# Altium schematic sheet STM32-ROMI_Rev_A_4_3V_5V.SchDoc: Power
size A; DocumentNumber: 7122020; Revision: A; SheetNumber: 4; SheetTotal: 7
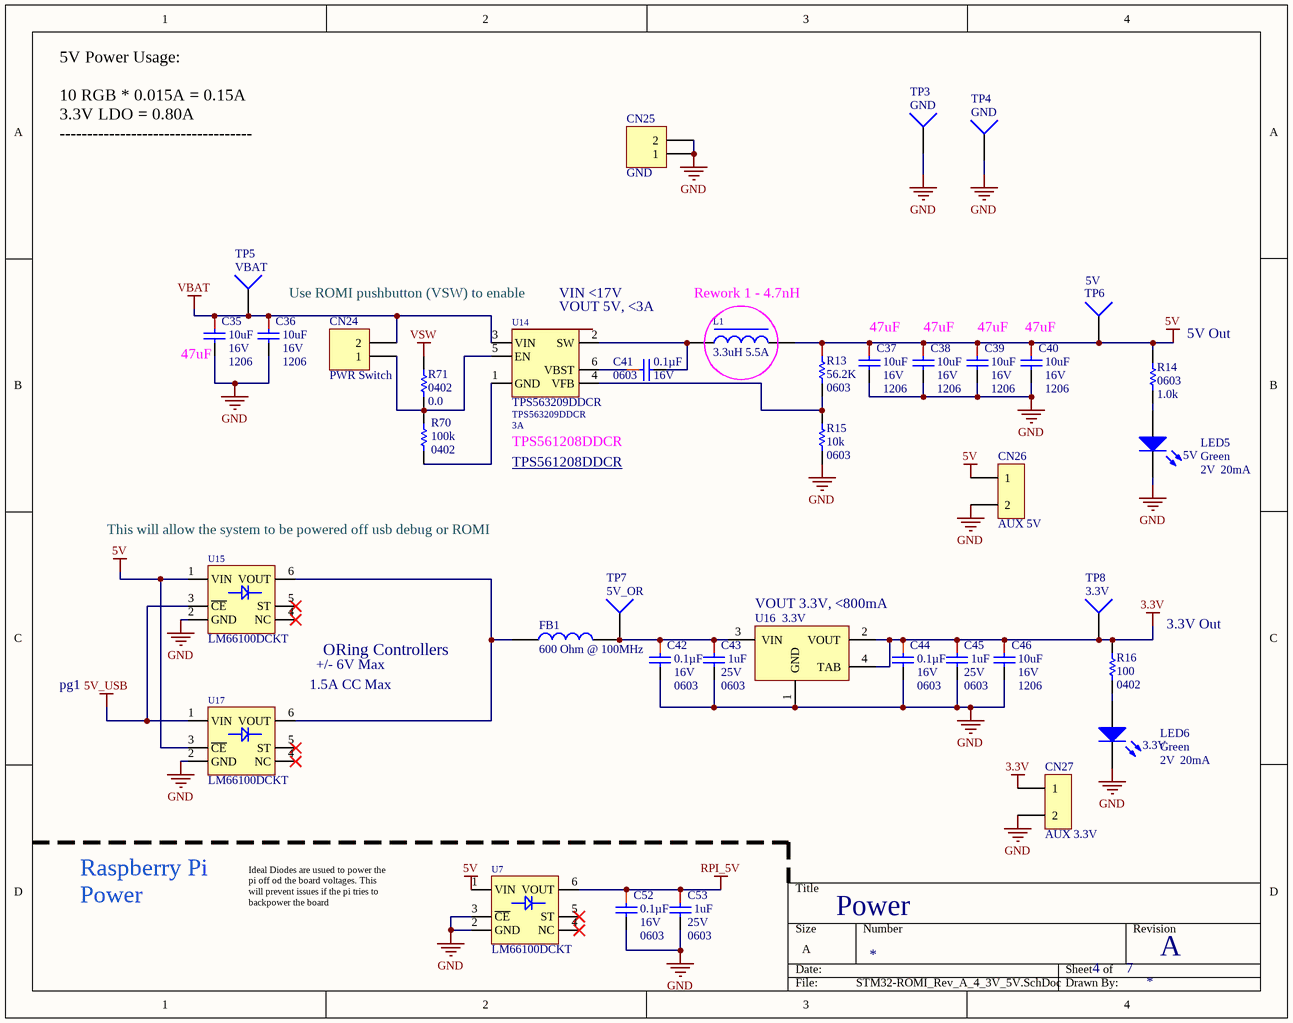
[diagram p0: STM32-ROMI_Rev_A_4_3V_5V.SchDoc]

## Parts
C35  10uF  Voltage - Rated: 16V  Package: 1206  [CAPC1206(3216)_M]
C36  10uF  Voltage - Rated: 16V  Package: 1206  [CAPC1206(3216)_M]
C37  10uF  Voltage - Rated: 16V  Package: 1206  [CAPC1206(3216)_M]
C38  10uF  Voltage - Rated: 16V  Package: 1206  [CAPC1206(3216)_M]
C39  10uF  Voltage - Rated: 16V  Package: 1206  [CAPC1206(3216)_M]
C40  10uF  Voltage - Rated: 16V  Package: 1206  [CAPC1206(3216)_M]
C41  Capacitance: 0.1µF  Package / Case: 0603  Voltage - Rated: 16V  [CAPC0603(1608)_L]  (hidden comment: 0.1uF)
C42  Capacitance: 0.1µF  Package / Case: 0603  Voltage - Rated: 16V  [CAPC0603(1608)_L]  (hidden comment: 0.1uF)
C43  1uF  Voltage - Rated: 25V  Package / Case: 0603  [CAPC0603(1608)_N]
C44  Capacitance: 0.1µF  Package / Case: 0603  Voltage - Rated: 16V  [CAPC0603(1608)_L]  (hidden comment: 0.1uF)
C45  1uF  Voltage - Rated: 25V  Package / Case: 0603  [CAPC0603(1608)_N]
C46  10uF  Voltage - Rated: 16V  Package: 1206  [CAPC1206(3216)_M]
C52  Capacitance: 0.1µF  Package / Case: 0603  Voltage - Rated: 16V  [CAPC0603(1608)_L]  (hidden comment: 0.1uF)
C53  1uF  Voltage - Rated: 25V  Package / Case: 0603  [CAPC0603(1608)_N]
CN24  PWR Switch  [HDR1X2]
CN25  GND  [HDR1X2]
CN26  AUX 5V  [Molex 1x2 Microfit 3.0]
CN27  AUX 3.3V  [Molex 1x2 Microfit 3.0]
FB1  600 Ohm @ 100MHz  [RESC0805(2012)_N]
L1  3.3uH 5.5A  [YSPI0530-3R3M]
LED5  5V  Color: Green  Voltage - Forward (Vf) (Typ): 2V  Current - Test: 20mA  [SM-LED-0603]
LED6  3.3V  Color: Green  Voltage - Forward (Vf) (Typ): 2V  Current - Test: 20mA  [SM-LED-0603]
R13  56.2K  Package / Case: 0603  [RESC0603(1608)_L]
R14  Package / Case: 0603  [RESC0603(1608)_N]  (hidden comment: 1.0K)
R15  Resistance (Ohms): 10k  Package / Case: 0603  [RESC0603(1608)_L]  (hidden comment: 10K 1%)
R16  100  Supplier Device Package: 0402  [RESC0402(1005)_N]
R70  Supplier Device Package: 0402  Resistance (Ohms): 100k  [RESC0402(1005)_L]  (hidden comment: 100K 0402)
R71  Supplier Device Package: 0402  Resistance (Ohms): 0.0  [RESC0402(1005)_L]  (hidden comment: 0)
TP3  GND  [TestPoint-SM]  (no BOM)
TP4  GND  [TestPoint-SM]  (no BOM)
TP5  VBAT  [TestPoint-SM]  (no BOM)
TP6  5V  [TestPoint-SM]  (no BOM)
TP7  5V_OR  [TestPoint-SM]  (no BOM)
TP8  3.3V  [TestPoint-SM]  (no BOM)
U7  LM66100DCKT  [SC-70-6]
U14  TPS563209DDCR  Current - Output: 3A  [SOT23-6]
U15  LM66100DCKT  [SC-70-6]
U16  3.3V  [DSO-G3]
U17  LM66100DCKT  [SC-70-6]

## Nets
3.3V: C44.1 C45.1 C46.1 CN27.1 R16.2 TP8.1 U16.2(VOUT) U16.4(TAB)
5V: C37.1 C38.1 C39.1 C40.1 CN26.1 L1.2 R13.1 R14.2 TP6.1 U7.1(VIN) U15.1(VIN) U17.3(~{CE})
5V_USB: U15.3(~{CE}) U17.1(VIN)
GND: C35.2 C36.2 C37.2 C38.2 C39.2 C40.2 C42.2 C43.2 C44.2 C45.2 C46.2 C52.2 C53.2 CN25.1 CN25.2 CN26.2 CN27.2 LED5.2 LED6.2 R15.1 TP3.1 TP4.1 U7.2(GND) U7.3(~{CE}) U15.2(GND) U16.1(GND) U17.2(GND)
RPI_5V: C52.1 C53.1 U7.6(VOUT)
VBAT: C35.1 C36.1 CN24.2 TP5.1 U14.3(VIN)
VSW: R71.1
NetC41_1: C41.1 U14.6(VBST)
NetC41_2: C41.2 L1.1 U14.2(SW)
NetC42_1: C42.1 C43.1 FB1.2 TP7.1 U16.3(VIN)
NetCN24_1: CN24.1 R70.2 R71.2 U14.5(EN)
NetFB1_1: FB1.1 U15.6(VOUT) U17.6(VOUT)
NetLED5_1: LED5.1 R14.1
NetLED6_1: LED6.1 R16.1
NetR13_2: R13.2 R15.2 U14.4(VFB)
NetR70_1: R70.1 U14.1(GND)

Not connected (* = marked no-connect by the designer): U7 4(NC)* 5(ST)*; U15 4(NC)* 5(ST)*; U17 4(NC)* 5(ST)*

## Notes on the sheet
- 5V Power Usage:
  10 RGB * 0.015A = 0.15A
  3.3V LDO = 0.80A
  -----------------------------------
  = 0.95A
- Use ROMI pushbutton (VSW) to enable
- (near U14) VIN <17V
- Rework 1 - 4.7nH
- (near C35) 47uF
- (near U14) VOUT 5V, <3A
- 47uF
- (near C40) 47uF
- (near R14) 5V Out
- TPS561208DDCR
- TPS561208DDCR <https://webench.ti.com/appinfo/webench/scripts/SDP.cgi?ID=1CC5C5774496E8D5>
- (near U15) This will allow the system to be powered off usb debug or ROMI
- (near U16) VOUT 3.3V, <800mA
- 3.3V Out
- pg1
- 1.5A CC Max
- +/- 6V Max
- ORing Controllers
- Raspberry Pi
- Power
- Ideal Diodes are usued to power the pi off od the board voltages. This will prevent issues if the pi tries to backpower the board

## Library data of the parts
C35-C40 C46 = CAP CER 10UF 16V 1206: Temperature Coefficient: X7R; LCSC: C126600; Capacitance: 10uF; Supplier 1: Digi-Key; Supplier Part Number 1: 490-4793-1-ND
C41 C42 C44 C52 = CAP CER 0.1UF 16V 10% X7R 0603: 0.1uF 0603 16V; Manufacturer: Kemet; Manufacturer Part Number: C0603C104K4RACTU; Tolerance: ±10%; Temperature Coefficient: X7R; Supplier 1: Digi-Key; RoHS: RoHS Compliant; Category: Capacitors; Stock 1: 2360000; Pricing 1: 4000=0.00414, 8000=0.00378, 12000=0.0036, 28000=0.00342, 100000=0.00248 (USD); Packaging: Tape & Reel (TR); Mounting Type: Surface Mount, MLCC; Operating Temperature: -55°C ~ 125°C; Applications: General Purpose; Ratings: -; Size / Dimension: 0.063" L x 0.031" W (1.60mm x 0.80mm); Height - Seated (Max): -; Thickness (Max): 0.034" (0.87mm); Lead Spacing: -; Features: -; Lead Style: -; ComponentLink1URL: http://www.kemet.com/datasheets&C0603C104K4RACTU; ComponentLink1Description: http://www.kemet.com/datasheets&C0603C104K4RACTU; Supplier Part Number 1: 399-1096-2-ND
C43 C45 C53 = CAP CER 1UF 25V 10% X7R 0603: 1uF 0603 25V; Manufacturer: TDK Corporation; Manufacturer Part Number: CGA3E1X7R1E105K080AC; Tolerance: ±10%; Temperature Coefficient: X7R; Supplier 1: Digi-Key; RoHS: RoHS Compliant; Category: Capacitors; Stock 1: 360610; Pricing 1: 1=0.2, 10=0.135, 100=0.0686, 500=0.04696, 1000=0.04154 (USD); Packaging: Cut Tape (CT); Part Status: Active; Operating Temperature: -55°C ~ 125°C; Features: -; Ratings: AEC-Q200; Applications: Automotive; Failure Rate: -; Mounting Type: Surface Mount, MLCC; Size / Dimension: 0.063" L x 0.032" W (1.60mm x 0.80mm); Height - Seated (Max): -; Thickness (Max): 0.035" (0.90mm); Lead Spacing: -; Lead Style: -; ComponentLink1URL: https://product.tdk.com/info/en/catalog/datasheets/mlcc_automotive_general_en.pdf; ComponentLink1Description: https://product.tdk.com/info/en/catalog/datasheets/mlcc_automotive_general_en.pdf; Supplier Part Number 1: 445-6931-1-ND
CN24 CN25 = Header 2: Header, 2-Pin; Manufacturer: Sullins Connector Solutions; Manufacturer Part Number: PRPC002SAAN-RC; Connector Type: Header, Unshrouded, Breakaway; Number of Positions: 2; Number of Positions Loaded: All; Pitch: 0.100" (2.54mm); Supplier 1: Digi-Key; RoHS: RoHS Compliant; Category: Connectors, Interconnects; Stock 1: 4300; Pricing 1: 1=0.16, 10=0.145, 100=0.1198, 500=0.09466, 1000=0.08127, 5000=0.07414, 10000=0.07129 (USD); Packaging: Bulk; Contact Type: Male Pin; Number of Rows: 1; Row Spacing: -; Contact Mating Length: 0.230" (5.84mm); Mounting Type: Through Hole; Termination: Solder; Fastening Type: -; Features: -; Contact Finish: Gold; Contact Finish Thickness: Flash; Color: Black; ComponentLink1URL: http://media.digikey.com/PDF/Data%20Sheets/Sullins%20PDFs/xRxCzzzSxxN-RC_ST_11635-B.pdf; ComponentLink1Description: http://media.digikey.com/PDF/Data%20Sheets/Sullins%20PDFs/xRxCzzzSxxN-RC_ST_11635-B.pdf; Supplier Part Number 1: S1011EC-02-ND
CN26 CN27 = MICROFIT 3.0 HDR VERT CPI 2CKT: Molex Microfit 1x2 Vert Header; Manufacturer: Molex, LLC; Manufacturer Part Number: 0430450227; Shrouding: Shrouded - 4 Wall; Number of Positions: 2; Number of Positions Loaded: All; Row Spacing: 0.118" (3.00mm); Supplier 1: Digi-Key; RoHS: RoHS Compliant; Category: Connectors, Interconnects; Stock 1: 4002; Pricing 1: 1=0.8, 10=0.705, 50=0.636, 100=0.6083, 250=0.553, 500=0.4977, 1000=0.4424, 2500=0.40092, 5000=0.3871 (USD); Packaging: Tray; Part Status: Active; Connector Type: Header; Contact Type: Male Pin; Pitch: -; Number of Rows: 2; Mounting Type: Through Hole; Termination: Solder; Fastening Type: Locking Ramp; Contact Mating Length: -; Features: Board Guide; Contact Finish: Tin; Contact Finish Thickness: 60µin (1.52µm); Color: Black; ComponentLink1URL: http://www.molex.com/pdm_docs/sd/430450227_sd.pdf; ComponentLink1Description: http://www.molex.com/pdm_docs/sd/430450227_sd.pdf; Supplier Part Number 1: WM10657-ND
FB1 = FERRITE 600 OHM 2.0A 0805: 600 OHM 0805 2.0A; Manufacturer: Wurth Electronics Inc; Manufacturer Part Number: 742792040; Current Rating: 2A; DC Resistance (DCR): 150 mOhm Max; Filter Type: Differential Mode - Single; Supplier 1: Digi-Key; RoHS: RoHS Compliant; Category: Filters; Stock 1: 34670; Pricing 1: 1=0.24, 50=0.2344, 100=0.2156, 500=0.20624, 1000=0.19687, 2000=0.1875 (USD); Packaging: Cut Tape (CT); Package / Case: 0805 (2012 Metric); Mounting Type: Surface Mount; Height (Max): 0.043" (1.10mm); Size / Dimension: 0.079" L x 0.047" W (2.00mm x 1.20mm); ComponentLink1URL: http://katalog.we-online.de/pbs/datasheet/742792040.pdf; ComponentLink1Description: http://katalog.we-online.de/pbs/datasheet/742792040.pdf; Supplier Part Number 1: 732-1620-1-ND; ClassName: *; Creator: osman; Impedance @ Frequency: 600 Ohm @ 100MHz
L1 = FIXED IND 3.3UH 5.5A 28 MOHM SMD: Power Inductors 3.3uH ±20% 5.5A SMD,5.2x4.7x3mm RoHS; LCSC: C351097; Manufacturer Part: YSPI0530-3R3M; ComponentLink1Description: https://datasheet.lcsc.com/szlcsc/1812181731_YJYCOIN-YSPI0530-3R3M_C351097.pdf; ComponentLink1URL: https://datasheet.lcsc.com/szlcsc/1812181731_YJYCOIN-YSPI0530-3R3M_C351097.pdf
LED5 LED6 = LTST-C191KGKT: LED GREEN CLEAR THIN 0603 SMD; Manufacturer: Lite-On Inc; Wavelength - Dominant: 571nm; Wavelength - Peak: 574nm; Millicandela Rating: 35mcd; Viewing Angle: 130°; Lens Style/Size: Rectangle with Flat Top, 1.1mm x 0.8mm; Supplier 1: Digi-Key; Manufacturer Part Number: LTST-C191KGKT; RoHS: RoHS Compliant; Category: Optoelectronics; Stock 1: 84829; Pricing 1: 1=0.3, 10=0.238, 100=0.1296, 250=0.0864, 500=0.07344, 1000=0.05616, 2500=0.05076 (USD); Packaging: Cut Tape (CT); Lens Type: Clear; Package / Case: 0603 (1608 Metric); Size / Dimension: 1.60mm L x 0.80mm W; Height: 0.55mm; Mounting Type: Surface Mount; Luminous Flux @ Current - Test: -; ComponentLink1URL: http://optoelectronics.liteon.com/upload/download/DS22-2000-228/S_110_LTST-C191KGKT.pdf; ComponentLink1Description: http://optoelectronics.liteon.com/upload/download/DS22-2000-228/S_110_LTST-C191KGKT.pdf; Supplier Part Number 1: 160-1446-1-ND; ClassName: *
R13 = RES SMD 56.2K OHM 1% 1/10W 0603: Power (Watts): 0.1W; Temperature Coefficient: ±100ppm/°C; Resistance: 56.2K; Supplier 1: Digi-Key; Supplier Part Number 1: P56.2KHCT-ND
R14 = RES 1K OHM 1% 1/10W 0603: 1.0K 0603; Manufacturer: Stackpole Electronics Inc.; Manufacturer Part Number: RMCF0603FT1K00; Tolerance: ±1%; Power (Watts): 0.1W, 1/10W; Temperature Coefficient: ±100ppm/°C; Supplier 1: Digi-Key; RoHS: RoHS Compliant; Category: Resistors; Stock 1: 411308; Pricing 1: 1=0.1, 10=0.02, 100=0.0081, 1000=0.00364, 2500=0.00316 (USD); Packaging: Cut Tape (CT); Part Status: Active; Composition: Thick Film; Features: Automotive AEC-Q200; Operating Temperature: -55°C ~ 155°C; Size / Dimension: 0.061" L x 0.031" W (1.55mm x 0.80mm); Height - Seated (Max): 0.022" (0.55mm); Failure Rate: -; ComponentLink1URL: https://www.seielect.com/Catalog/SEI-RMCF_RMCP.pdf; ComponentLink1Description: https://www.seielect.com/Catalog/SEI-RMCF_RMCP.pdf; Supplier Part Number 1: RMCF0603FT1K00CT-ND; Supplier Device Package: 0603; Resistance (Ohms): 1.0k
R15 = RES 10K OHM 1/10W 1% 0603 SMD: 10K 0603; Manufacturer: Panasonic Electronic Components; Manufacturer Part Number: ERJ-3EKF1002V; Power (Watts): 0.1W, 1/10W; Temperature Coefficient: ±100ppm/°C; Category: Resistors; Supplier 1: Digi-Key; RoHS: RoHS Compliant; Stock 1: 5046430; Pricing 1: 1=0.1, 50=0.015, 100=0.0114, 250=0.00844, 500=0.00624, 1000=0.00416, 2500=0.00351 (USD); Packaging: Cut Tape (CT); Tolerance: ±1%; Composition: Thick Film; Features: -; Supplier Device Package: 0603; Size / Dimension: 0.063" L x 0.031" W (1.60mm x 0.80mm); Height: 0.022" (0.55mm); Number of Terminations: 2; ComponentLink1URL: http://industrial.panasonic.com/www-cgi/jvcr13pz.cgi?E+PZ+3+AOA0002+ERJ3EKF1002V+7+WW; ComponentLink1Description: http://industrial.panasonic.com/www-cgi/jvcr13pz.cgi?E+PZ+3+AOA0002+ERJ3EKF1002V+7+WW; Supplier Part Number 1: P10.0KHCT-ND
R16 = RES 100 OHM 1% 1/16W 0402: 100 0402; Manufacturer: Yageo; Manufacturer Part Number: RC0402FR-07100RL; Tolerance: ±1%; Power (Watts): 0.063W, 1/16W; Temperature Coefficient: ±100ppm/°C; Supplier 1: Digi-Key; RoHS: RoHS Compliant; Category: Resistors; Stock 1: 14557677; Pricing 1: 1=0.1, 10=0.014, 100=0.0056, 1000=0.00253, 2500=0.0022, 5000=0.00181 (USD); Packaging: Cut Tape (CT); Part Status: Active; Composition: Thick Film; Features: Moisture Resistant; Operating Temperature: -55°C ~ 155°C; Package / Case: 0402 (1005 Metric); Size / Dimension: 0.039" L x 0.020" W (1.00mm x 0.50mm); Height - Seated (Max): 0.016" (0.40mm); Failure Rate: -; ComponentLink1URL: http://www.yageo.com/documents/recent/PYu-RC_Group_51_RoHS_L_8.pdf; ComponentLink1Description: http://www.yageo.com/documents/recent/PYu-RC_Group_51_RoHS_L_8.pdf; Supplier Part Number 1: 311-100LRCT-ND
R70 = RES 100K OHM 1% 1/16W 0402: Manufacturer: Yageo; Manufacturer Part Number: RC0402FR-07100KL; Power (Watts): 0.1W, 1/10W; Temperature Coefficient: ±100ppm/°C; Tolerance: ±1%; RoHS: RoHS Compliant; Category: Resistors; Stock 1: 3706939; Pricing 1: 1=0.1, 50=0.0196, 100=0.0149, 250=0.01104, 500=0.00816, 1000=0.00544, 5000=0.00383 (USD); Packaging: Cut Tape (CT); Composition: Thick Film; Features: Automotive AEC-Q200; Operating Temperature: -55°C ~ 155°C; Package / Case: 0402 (1005 Metric); Size / Dimension: 0.039" L x 0.020" W (1.00mm x 0.50mm); Height: 0.016" (0.40mm); Number of Terminations: 2; ComponentLink1URL: http://industrial.panasonic.com/www-cgi/jvcr13pz.cgi?E+PZ+3+AOA0002+ERJ2RKF1003X+7+WW; ComponentLink1Description: http://industrial.panasonic.com/www-cgi/jvcr13pz.cgi?E+PZ+3+AOA0002+ERJ2RKF1003X+7+WW; Supplier 1: Digi-Key; Supplier 2: Digi-Key; Supplier Part Number 1: 311-100KLRCT-ND; Supplier Part Number 2: RMCF0402FT100KCT-ND
R71 = RES 0.0 OHM JUMPER 1/10W 0402: 0.0 0402; Manufacturer: Panasonic Electronic Components; Manufacturer Part Number: ERJ-2GE0R00X; Tolerance: Jumper; Power (Watts): 0.1W, 1/10W; Supplier 1: Digi-Key; RoHS: RoHS Compliant; Category: Resistors; Stock 1: 8429476; Pricing 1: 1=0.1, 50=0.0138, 100=0.0105, 250=0.0078, 500=0.00576, 1000=0.00384, 5000=0.0027 (USD); Packaging: Cut Tape (CT); Composition: Thick Film; Features: Automotive AEC-Q200; Temperature Coefficient: -; Operating Temperature: -55°C ~ 155°C; Package / Case: 0402 (1005 Metric); Size / Dimension: 0.039" L x 0.020" W (1.00mm x 0.50mm); Height: 0.016" (0.40mm); Number of Terminations: 2; ComponentLink1URL: http://industrial.panasonic.com/www-cgi/jvcr13pz.cgi?E+PZ+3+AOA0001+ERJ2GE0R00X+7+WW; ComponentLink1Description: http://industrial.panasonic.com/www-cgi/jvcr13pz.cgi?E+PZ+3+AOA0001+ERJ2GE0R00X+7+WW; Supplier Part Number 1: P0.0JCT-ND; Creator: osman
TP3-TP8 = TestPoint: Test Point
U7 U15 U17 = LM66100DCKT: OR Controller P-Channel 1.5A CC
U14 = TPS563209DDCR: IC REG BUCK ADJ 3A TSOT23-6; Voltage - Input (Min): 4.5V; Voltage - Input (Max): 17V; Voltage - Output (Min/Fixed): 0.765V; Voltage - Output (Max): 7V; Frequency - Switching: 650KHZ; Topology: Buck; Supplier Device Package: TSOT-23-6; Manufacturer Part Number: TPS563209DDCR; Supplier 1: Digi-Key; Supplier Part Number 1: 296-40813-1-ND
U16 = LD1117S33: 3.3 volt fixed regulator, 800mA; Supplier 1: Digi-Key; Supplier Part Number 1: 497-1242-1-ND